# Altium schematic sheet 5_demodulation.SchDoc
size A; SheetNumber: 5; SheetTotal: 7
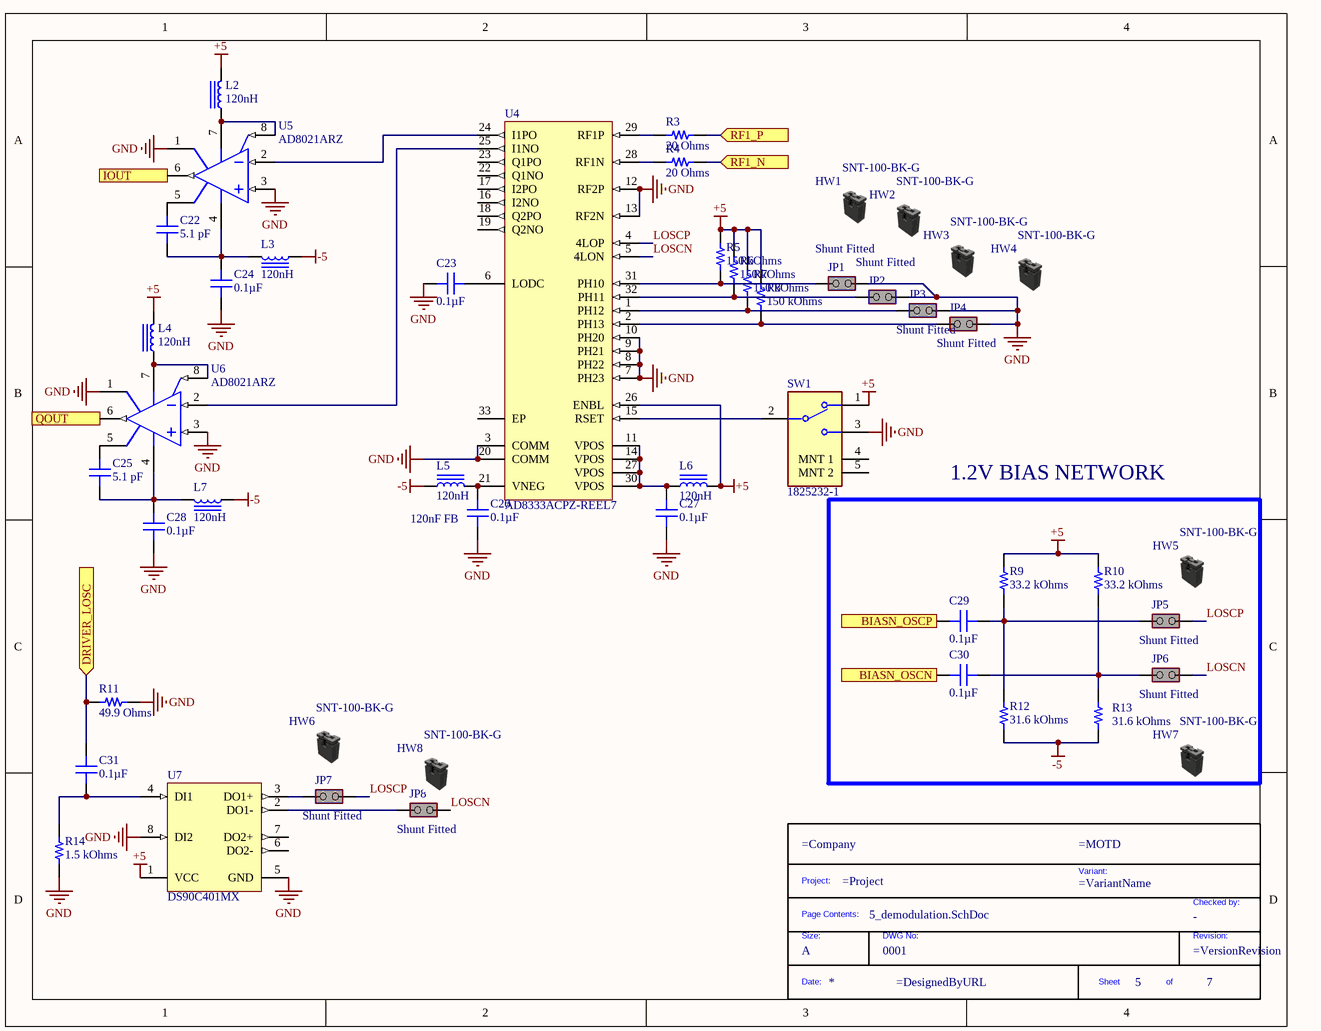
[diagram p0: 5_demodulation.SchDoc]

## Parts
*?  DWG No: 0001  Size: A  (hidden comment: TitleBlock)  (graphical)
C22  5.1 pF  [CAP 1206_3216 - 0.8MM]
C23  0.1µF  [CAP 1206_3216 - 1.0MM]
C24  0.1µF  [CAP 1206_3216 - 1.0MM]
C25  5.1 pF  [CAP 1206_3216 - 0.8MM]
C26  0.1µF  [CAP 1206_3216 - 1.0MM]
C27  0.1µF  [CAP 1206_3216 - 1.0MM]
C28  0.1µF  [CAP 1206_3216 - 1.0MM]
C29  0.1µF  [CAP 1206_3216 - 1.0MM]
C30  0.1µF  [CAP 1206_3216 - 1.0MM]
C31  0.1µF  [CAP 1206_3216 - 1.0MM]
HW1  value SNT-100-BK-G  (hidden comment: Shunt Black 2.54mm)  (mechanical)
HW2  value SNT-100-BK-G  (hidden comment: Shunt Black 2.54mm)  (mechanical)
HW3  value SNT-100-BK-G  (hidden comment: Shunt Black 2.54mm)  (mechanical)
HW4  value SNT-100-BK-G  (hidden comment: Shunt Black 2.54mm)  (mechanical)
HW5  value SNT-100-BK-G  (hidden comment: Shunt Black 2.54mm)  (mechanical)
HW6  value SNT-100-BK-G  (hidden comment: Shunt Black 2.54mm)  (mechanical)
HW7  value SNT-100-BK-G  (hidden comment: Shunt Black 2.54mm)  (mechanical)
HW8  value SNT-100-BK-G  (hidden comment: Shunt Black 2.54mm)  (mechanical)
JP1  value Shunt Fitted  [CON_SAMTEC_TSW-102-07-G-S]  (hidden comment: Jumper_Header 2x1 Fitted)
JP2  value Shunt Fitted  [CON_SAMTEC_TSW-102-07-G-S]  (hidden comment: Jumper_Header 2x1 Fitted)
JP3  value Shunt Fitted  [CON_SAMTEC_TSW-102-07-G-S]  (hidden comment: Jumper_Header 2x1 Fitted)
JP4  value Shunt Fitted  [CON_SAMTEC_TSW-102-07-G-S]  (hidden comment: Jumper_Header 2x1 Fitted)
JP5  value Shunt Fitted  [CON_SAMTEC_TSW-102-07-G-S]  (hidden comment: Jumper_Header 2x1 Fitted)
JP6  value Shunt Fitted  [CON_SAMTEC_TSW-102-07-G-S]  (hidden comment: Jumper_Header 2x1 Fitted)
JP7  value Shunt Fitted  [CON_SAMTEC_TSW-102-07-G-S]  (hidden comment: Jumper_Header 2x1 Fitted)
JP8  value Shunt Fitted  [CON_SAMTEC_TSW-102-07-G-S]  (hidden comment: Jumper_Header 2x1 Fitted)
L2  120nH  [IND 0603_1608 RF WW]
L3  120nH  [IND 0603_1608 RF WW]
L4  120nH  [IND 0603_1608 RF WW]
L5  120nH  [IND 0603_1608 RF WW]
L6  120nH  [IND 0603_1608 RF WW]
L7  120nH  [IND 0603_1608 RF WW]
R3  20 Ohms  [RES 1206_3216]
R4  20 Ohms  [RES 1206_3216]
R5  150 kOhms  [RES 1206_3216]
R6  150 kOhms  [RES 1206_3216]
R7  150 kOhms  [RES 1206_3216]
R8  150 kOhms  [RES 1206_3216]
R9  33.2 kOhms  [RES 1206_3216]
R10  33.2 kOhms  [RES 1206_3216]
R11  49.9 Ohms  [RES 1206_3216]
R12  31.6 kOhms  [RES 1206_3216]
R13  31.6 kOhms  [RES 1206_3216]
R14  1.5 kOhms  [RES 1206_3216]
SW1  1825232-1  [FP-1825232-1-MFG]
U4  AD8333ACPZ-REEL7  [ADI-CP-32-2_L]
U5  AD8021ARZ  [ADI-R-8_N]
U6  AD8021ARZ  [ADI-R-8_N]
U7  DS90C401MX  [D0008A_N]

## Blocks framed on the sheet
1.2V BIAS NETWORK: C29 C30 HW5 HW7 JP5 JP6 R9 R10 R12 R13

## Ports
BIASN_OSCN (in), BIASN_OSCP (in), DRIVER_LOSC (in), IOUT (out), QOUT (out), RF1_N (in), RF1_P (in)

## Nets
+5: L2.2 L4.2 L6.2 R5.2 R6.2 R7.2 R8.2 R9.2 R10.2 SW1.1 U4.26(ENBL) U7.1(VCC)
-5: L3.1 L5.1 L7.1 R12.2 R13.1
GND: C23.2 C24.2 C26.1 C27.1 C28.2 JP1.2(NO) JP2.2(NO) JP3.2(NO) JP4.2(NO) R11.2 R14.2 SW1.3 U4.3(COMM) U4.7(PH23) U4.8(PH22) U4.9(PH21) U4.10(PH20) U4.12(RF2P) U4.13(RF2N) U4.20(COMM) U5.1(LOGIC_REFERENCE) U5.3(+IN) U6.1(LOGIC_REFERENCE) U6.3(+IN) U7.5(GND) U7.8(DI2)
BIASN_OSCN: C30.2 ; port BIASN_OSCN
BIASN_OSCP: C29.2 ; port BIASN_OSCP
DRIVER_LOSC: C31.2 R11.1 ; port DRIVER_LOSC
IOUT: U5.6(VOUT) ; port IOUT
LOSCN: JP6.2(NO) JP8.2(NO) U4.5(4LON)
LOSCP: JP5.2(NO) JP7.2(NO) U4.4(4LOP)
QOUT: U6.6(VOUT) ; port QOUT
RF1_N: R4.2 ; port RF1_N
RF1_P: R3.2 ; port RF1_P
NetC22_1: C22.1 C24.1 L3.2 U5.4(-VS)
NetC22_2: C22.2 U5.5(CCOMP)
NetC23_1: C23.1 U4.6(LODC)
NetC25_1: C25.1 C28.1 L7.2 U6.4(-VS)
NetC25_2: C25.2 U6.5(CCOMP)
NetC26_2: C26.2 L5.2 U4.21(VNEG)
NetC27_2: C27.2 L6.1 U4.11(VPOS) U4.14(VPOS) U4.27(VPOS) U4.30(VPOS)
NetC29_1: C29.1 JP5.1(COMMON) R9.1 R12.1
NetC30_1: C30.1 JP6.1(COMMON) R10.1 R13.2
NetC31_1: C31.1 R14.1 U7.4(DI1)
NetJP1_1: JP1.1(COMMON) R5.1 U4.31(PH10)
NetJP2_1: JP2.1(COMMON) R6.1 U4.32(PH11)
NetJP3_1: JP3.1(COMMON) R7.1 U4.1(PH12)
NetJP4_1: JP4.1(COMMON) R8.1 U4.2(PH13)
NetJP7_1: JP7.1(COMMON) U7.3(DO1+)
NetJP8_1: JP8.1(COMMON) U7.2(DO1-)
NetL2_1: L2.1 U5.7(+VS) U5.8(~{DISABLE})
NetL4_1: L4.1 U6.7(+VS) U6.8(~{DISABLE})
NetR3_1: R3.1 U4.29(RF1P)
NetR4_1: R4.1 U4.28(RF1N)
NetSW1_2: SW1.2 U4.15(RSET)
NetU4_24: U4.24(I1PO) U5.2(-IN)
NetU4_25: U4.25(I1NO) U6.2(-IN)

Not connected (* = marked no-connect by the designer): SW1 4(MNT_1) 5(MNT_2); U4 16(I2NO) 17(I2PO) 18(Q2PO) 19(Q2NO) 22(Q1NO) 23(Q1PO) 33(EP); U7 6(DO2-) 7(DO2+)

## Notes on the sheet
- 120nF FB
- (in symbol TitleBlock) Project:; Variant:; Checked by:; Page Contents:; Size:; DWG No:; Revision:; Date:; Sheet; of

## Library data of the parts
*? = TitleBlock: Standard Title Block; Checked by: -
C22 C25 = C1206C519C5GAC7800: CAP CER 5.1PF 50V C0G/NP0 1206; manufacturer: KEMET; Temperature Coefficient: C0G, NP0; Tolerance: ±0.25pF; Part Number: C1206C519C5GAC7800; Value: 5.1 pF; Applications: General Purpose; Capacitance: 5.1 pF; componentlink1description: Datasheet; componentlink1url: https://api.kemet.com/component-edge/download/datasheet/C1206C519C5GACTU.pdf; componentlink2description: DigiKey Link; componentlink2url: https://www.digikey.com/en/products/detail/kemet/C1206C519C5GAC7800/411185; Device Package: 1206 (3216 Metric); Features: Low ESL; lastupdated: 2023-04-30 19:15:17; Lifecycle Status: Active; Minimum Order: 1; Mounting Type: Surface Mount, MLCC; Operating Temperature: -55°C ~ 125°C; Package / Case: 1206 (3216 Metric); packaging: TapeAndReel; partid: 30067; Part Status: Active; price: 0.16; series: SMD Comm C0G; Size / Dimension: 0.126" L x 0.063" W (3.20mm x 1.60mm); Supplier 1: DigiKey; Supplier Part Number 1: 399-C1206C519C5GAC7800CT-ND; Thickness (Max): 0.035" (0.88mm); Voltage - Rated: 50V
C23 C24 C26-C31 = 12065C104JAT2A: CAP CER 0.1UF 50V X7R 1206; manufacturer: AVX Corporation; Tolerance: ±5%; Part Number: 12065C104JAT2A; Value: 0.1µF; Applications: General Purpose; Capacitance: 0.1µF; componentlink1description: Datasheet; componentlink1url: http://datasheets.avx.com/X7RDielectric.pdf; componentlink2description: DigiKey Link; componentlink2url: http://digikey.com/product-detail/en/avx-corporation/12065C104JAT2A/478-3797-1-ND/1116495; Device Package: 1206 (3216 Metric); lastupdated: 2020-09-02 01:05:06; Lifecycle Status: Active; Minimum Order: 1; Mounting Type: Surface Mount, MLCC; Operating Temperature: -55°C ~ 125°C; Package / Case: 1206 (3216 Metric); packaging: TapeAndReel; partid: 19088; Part Status: Active; price: 0.06; series: -; Size / Dimension: 0.126" L x 0.063" W (3.20mm x 1.60mm); Supplier 1: DigiKey; Supplier Part Number 1: 478-3797-1-ND; Temperature Coefficient: X7R; Thickness (Max): 0.037" (0.94mm); Voltage - Rated: 50V
HW1-HW8 = MCD-00043: SHUNT 2.54mm BLACK; Manufacturer: SAMTEC; Part_Type: Mechanical; Alternate_Manufacturer_Part_Number: 316102S111A; Alternate_Manufacturer: JIUBABA; Provided_By: SUBCO; Internal_Part_Number: MCD-00043; Manufacturer_Part_Number: SNT-100-BK-G; ComponentLink1Description: Datasheet; Status: Released; ComponentLink1URL: http://tunmcdsvn.tun.st.com/Component_Datasheet_Library/Trunk/Connectors/Samtec_Shunt_Jumper_SNT100; ECCN_US: n/a; ECCN_EU: n/a
JP1-JP8 = MCD-00683: Header, 2x1, 2,54mm, VR, TH, Height 5.84mm/2.54mm - Shunt Fitted by default; Part_Type: Connector; Manufacturer_Part_Number: TSW-102-07-x-S; Manufacturer: SAMTEC; Alternate_Manufacturer_Part_Number: 313102S111116; Alternate_Manufacturer: LIANYI; Provided_By: SUBCO; Internal_Part_Number: MCD-00683; Status: Released; ComponentLink1Description: Datasheet; ComponentLink1URL: http://tunmcdsvn.tun.st.com/Component_Datasheet_Library/Trunk/Connectors/Samtec_TSW-HTSW-series; ECCN_US: n/a; ECCN_EU: n/a
L2-L4 L6 L7 = LQW18CAR12J00D: FIXED IND 120NH 1500MA 58MOHM; Manufacturer: Murata Electronics; Current Rating (Amps): 1.5A; DC Resistance (DCR): 58mOhm Max; Frequency - Self Resonant: 1.5GHz; Inductance Frequency - Test: 10MHz; Material - Core: Ferrite; Shielding: Unshielded; Tolerance: ±5%; Type: Wirewound; Part Number: LQW18CAR12J00D; ComponentLink1Description: Datasheet; ComponentLink1URL: https://search.murata.co.jp/Ceramy/image/img/P02/JELF243A-0159.pdf; ComponentLink2Description: DigiKey Link; ComponentLink2URL: http://digikey.com/product-detail/en/murata-electronics/LQW18CAR12J00D/490-18177-1-ND/9742079; Device Package: 0603 (1608 Metric); Height - Seated (Max): 0.037" (0.95mm); Inductance: 120nH; LastUpdated: 2020-09-06 11:05:19; Lifecycle Status: Active; Minimum Order: 1; Mounting Type: Surface Mount; Operating Temperature: -40°C ~ 85°C; Package / Case: 0603 (1608 Metric); Packaging: TapeAndReel; PartId: 1197; Part Status: Active; Price: 0.22; Series: LQW18; Size / Dimension: 0.063" L x 0.031" W (1.60mm x 0.80mm); Supplier 1: DigiKey; Supplier Part Number 1: 490-18177-1-ND; Supplier Device Package: 0603; Value: 120nH
L5 = 744761212C: FIXED IND 120NH 300MA 650 MOHM; Manufacturer: Würth Elektronik; DC Resistance (DCR): 650mOhm Max; Frequency - Self Resonant: 1.3GHz; Inductance Frequency - Test: 150MHz; Material - Core: Ceramic; Q @ Freq: 30 @ 150MHz; Shielding: Unshielded; Tolerance: ±5%; Type: Wirewound; Part Number: 744761212C; ComponentLink1Description: Datasheet; ComponentLink1URL: https://katalog.we-online.de/pbs/datasheet/744761212C.pdf; ComponentLink2Description: DigiKey Link; ComponentLink2URL: http://digikey.com/product-detail/en/w-rth-elektronik/744761212C/732-1768-1-ND/1994348; Current Rating (Amps): 300mA; Device Package: 0603 (1608 Metric); Height - Seated (Max): 0.043" (1.10mm); Inductance: 120nH; LastUpdated: 2020-09-06 11:05:21; Lifecycle Status: Active; Minimum Order: 1; Mounting Type: Surface Mount; Operating Temperature: -40°C ~ 125°C; Package / Case: 0603 (1608 Metric); Packaging: TapeAndReel; PartId: 1481; Part Status: Active; Price: 0.23; Series: WE-KI; Size / Dimension: 0.065" L x 0.045" W (1.65mm x 1.15mm); Supplier 1: DigiKey; Supplier Part Number 1: 732-1768-1-ND; Supplier Device Package: 0603 (1608 Metric); Value: 120nH
R3 R4 = RNCP1206FTD20R0: RES 20 OHM 1% 1/2W 1206; Manufacturer: Stackpole Electronics Inc; Power (Watts): 0.5W, 1/2W; Temperature Coefficient: ±100ppm/°C; Part Number: RNCP1206FTD20R0; ComponentLink1Description: Datasheet; ComponentLink1URL: https://www.seielect.com/catalog/sei-rncp.pdf; ComponentLink2Description: DigiKey Link; ComponentLink2URL: https://www.digikey.com/en/products/detail/stackpole-electronics-inc/RNCP1206FTD20R0/2240306; Composition: Thin Film; Device Package: 1206 (3216 Metric); Features: Anti-Sulfur; Height - Seated (Max): 0.025" (0.65mm); LastUpdated: 2022-09-19 13:29:44; Lifecycle Status: Active; Minimum Order: 1; Number of Terminations: 2; Operating Temperature: -55°C ~ 155°C; Package / Case: 1206 (3216 Metric); Packaging: TapeAndReel; PartId: 29216; Part Status: Active; Price: 0.01; Resistance: 20 Ohms; Series: RNCP; Size / Dimension: 0.122" L x 0.059" W (3.10mm x 1.50mm); Supplier 1: DigiKey; Supplier Part Number 1: RNCP1206FTD20R0CT-ND; Supplier Device Package: 1206; Tolerance: ±1%; Value: 20 Ohms
R5-R8 = KTR18EZPF1503: RES SMD 150K OHM 1% 1/4W 1206; Manufacturer: Rohm Semiconductor; Power (Watts): 0.25W, 1/4W; Temperature Coefficient: ±100ppm/°C; Part Number: KTR18EZPF1503; ComponentLink1Description: Datasheet; ComponentLink1URL: https://www.rohm.com/datasheet/KTR03EZPF/ktr-e; ComponentLink2Description: DigiKey Link; ComponentLink2URL: https://www.digikey.com/en/products/detail/rohm-semiconductor/KTR18EZPF1503/1983702; Composition: Thick Film; Device Package: 1206 (3216 Metric); Features: Automotive AEC-Q200, High Voltage; Height - Seated (Max): 0.026" (0.65mm); LastUpdated: 2022-09-19 13:29:15; Lifecycle Status: Active; Minimum Order: 1; Number of Terminations: 2; Operating Temperature: -55°C ~ 155°C; Package / Case: 1206 (3216 Metric); Packaging: TapeAndReel; PartId: 35710; Part Status: Active; Price: 0.03; Ratings: AEC-Q200; Resistance: 150 kOhms; Series: KTR; Size / Dimension: 0.126" L x 0.063" W (3.20mm x 1.60mm); Supplier 1: DigiKey; Supplier Part Number 1: RHM150KAICT-ND; Supplier Device Package: 1206; Tolerance: ±1%; Value: 150 kOhms
R9 R10 = RK73H2BTTD3322F: RES 33.2K OHM 1% 1/4W 1206; Manufacturer: KOA Speer Electronics, Inc.; Power (Watts): 0.25W, 1/4W; Temperature Coefficient: ±100ppm/°C; Part Number: RK73H2BTTD3322F; ComponentLink1Description: Datasheet; ComponentLink1URL: http://www.koaspeer.com/catimages/Products/RK73H/RK73H.pdf; ComponentLink2Description: DigiKey Link; ComponentLink2URL: https://www.digikey.com/en/products/detail/koa-speer-electronics-inc/RK73H2BTTD3322F/10235905; Composition: Thick Film; Device Package: 1206 (3216 Metric); Features: Automotive AEC-Q200, Moisture Resistant; Height - Seated (Max): 0.028" (0.70mm); LastUpdated: 2022-09-19 13:29:27; Lifecycle Status: Active; Minimum Order: 1; Number of Terminations: 2; Operating Temperature: -55°C ~ 155°C; Package / Case: 1206 (3216 Metric); Packaging: CutTape; PartId: 33401; Part Status: Active; Price: 0.01; Ratings: AEC-Q200; Resistance: 33.2 kOhms; Series: RK73H; Size / Dimension: 0.126" L x 0.063" W (3.20mm x 1.60mm); Supplier 1: DigiKey; Supplier Part Number 1: 2019-RK73H2BTTD3322FCT-ND; Supplier Device Package: 1206; Tolerance: ±1%; Value: 33.2 kOhms
R11 = RT1206BRD0749R9L: RES SMD 49.9 OHM 0.1% 1/4W 1206; Manufacturer: Yageo; Power (Watts): 0.25W, 1/4W; Temperature Coefficient: ±25ppm/°C; Part Number: RT1206BRD0749R9L; ComponentLink1Description: Datasheet; ComponentLink1URL: https://www.yageo.com/upload/media/product/productsearch/datasheet/rchip/PYu-RT_1-to-0.01_RoHS_L_11.pdf; ComponentLink2Description: DigiKey Link; ComponentLink2URL: https://www.digikey.com/en/products/detail/yageo/RT1206BRD0749R9L/1079849; Composition: Thin Film; Device Package: 1206 (3216 Metric); Height - Seated (Max): 0.026" (0.65mm); LastUpdated: 2023-04-30 19:44:00; Lifecycle Status: Active; Minimum Order: 1; Number of Terminations: 2; Operating Temperature: -55°C ~ 155°C; Package / Case: 1206 (3216 Metric); Packaging: TapeAndReel; PartId: 26863; Part Status: Active; Price: 0.09; Resistance: 49.9 Ohms; Series: RT; Size / Dimension: 0.122" L x 0.063" W (3.10mm x 1.60mm); Supplier 1: DigiKey; Supplier Part Number 1: YAG5080CT-ND; Supplier Device Package: 1206; Tolerance: ±0.1%; Value: 49.9 Ohms
R12 R13 = RC1206FR-0731K6L: RES 31.6K OHM 1% 1/4W 1206; Manufacturer: Yageo; Power (Watts): 0.25W, 1/4W; Temperature Coefficient: ±100ppm/°C; Part Number: RC1206FR-0731K6L; ComponentLink1Description: Datasheet; ComponentLink1URL: https://www.yageo.com/upload/media/product/productsearch/datasheet/rchip/PYu-RC_Group_51_RoHS_L_10.pdf; ComponentLink2Description: DigiKey Link; ComponentLink2URL: https://www.digikey.com/en/products/detail/yageo/RC1206FR-0731K6L/728811; Composition: Thick Film; Device Package: 1206 (3216 Metric); Features: Moisture Resistant; Height - Seated (Max): 0.026" (0.65mm); LastUpdated: 2022-09-19 13:29:31; Lifecycle Status: Active; Minimum Order: 1; Number of Terminations: 2; Operating Temperature: -55°C ~ 155°C; Package / Case: 1206 (3216 Metric); Packaging: TapeAndReel; PartId: 32438; Part Status: Active; Price: 0.01; Resistance: 31.6 kOhms; Series: RC_L; Size / Dimension: 0.122" L x 0.063" W (3.10mm x 1.60mm); Supplier 1: DigiKey; Supplier Part Number 1: 311-31.6KFRCT-ND; Supplier Device Package: 1206; Tolerance: ±1%; Value: 31.6 kOhms
R14 = CRGP1206F1K5: RES 1.5K OHM 1% 1/2W 1206; Manufacturer: TE Connectivity Passive Product; Power (Watts): 0.5W, 1/2W; Temperature Coefficient: ±100ppm/°C; Part Number: CRGP1206F1K5; ComponentLink1Description: Datasheet; ComponentLink1URL: https://www.te.com/commerce/DocumentDelivery/DDEController?Action=srchrtrv&DocNm=9-1773463-9&DocType=DS&DocLang=English; ComponentLink2Description: DigiKey Link; ComponentLink2URL: https://www.digikey.com/en/products/detail/te-connectivity-passive-product/CRGP1206F1K5/8577142; Composition: Thick Film; Device Package: 1206 (3216 Metric); Features: Pulse Withstanding; Height - Seated (Max): 0.026" (0.65mm); LastUpdated: 2023-04-30 19:43:51; Lifecycle Status: Active; Minimum Order: 1; Number of Terminations: 2; Operating Temperature: -55°C ~ 155°C; Package / Case: 1206 (3216 Metric); Packaging: TapeAndReel; PartId: 27822; Part Status: Active; Price: 0.03; Resistance: 1.5 kOhms; Series: CRGP; Size / Dimension: 0.122" L x 0.061" W (3.10mm x 1.55mm); Supplier 1: DigiKey; Supplier Part Number 1: A130540CT-ND; Supplier Device Package: 1206; Tolerance: ±1%; Value: 1.5 kOhms
SW1 = CMP-03405-000001-1: SWITCH SLIDE SPDT 200MA 30V; Manufacturer: TE Connectivity; Contact Current Rating: 0.2A; Contact Resistance: 20mΩ; Electromechanical Life: 10000Cycles; Operating Force: 200gf; Throw Configuration: SPDT; Manufacturer Part Number: 1825232-1; Temperature Range High: +70°C; Height: 3.7mm; ComponentLink2URL: https://www.te.com/commerce/DocumentDelivery/DDEController?Action=showdoc&DocId=Customer+Drawing%7F1825232%7FB2%7Fpdf%7FEnglish%7FENG_CD_1825232_B2.pdf%7F1825232-1; Mount: Through Hole; Mouser Description: Slide Switches SLIDE SWITCH SPDT Right Angle; Package: 1825232-1; Temperature: -20°C to +70°C; Automotive: No; ComponentLink2Description: Datasheet; Lead Free: Yes; Octopart: https://octopart.com/1825232-1-te+connectivity-45209882; Device Class L1: Electromechanical; Digikey Description: SWITCH SLIDE SPDT 200MA 30V; Device Class L3: Slide Switches; Device Class L2: Switches; Voltage Rating Dc: 30V; Temperature Range Low: -20°C; Category: Switch; RoHS: TRUE
U4 = CMP-0285-00056-1: DC to 50 MHz, Dual I/Q Demodulator and Phase Shifter, CP-32-2, Pb-Free, 1500 Reel; Min RF Frequency (MHz): 0Hz; Amplitude Error (dB): 50mdB; IIP3 (+dBm): 30dBm; Phase Error (deg): 0.1Deg; Max RF Frequency (MHz): 50MHz; DatasheetVersion: Rev. D; ComponentLink1URL: www.analog.com; ComponentLink2Description: Datasheet; Code_JEDEC: MO-220-VHHD-2; ComponentLink3Description: Package Specification; PackageDescription: 32-Lead Lead Frame Chip Scale Package [LFCSP_VQ]; ComponentLink3URL: http://www.analog.com/static/imported-files/packages/414143737956480539664569CP_32_2.pdf; PackageReference: CP-32-2; ComponentLink1Description: Manufacturer URL; PackageVersion: Jan-2005; ComponentLink2URL: http://www.analog.com/static/imported-files/data_sheets/AD8333.pdf
U5 U6 = CMP-0384-00646-2: Single Channel Low Power Operational Amplifier, 490 MHz BW, 120 V/us SR, Industrial, 8-pin SOIC (R-8), Tube; Manufacturer: Analog Devices; Generic Part Number: AD8021; Small Signal Bandwidth: 490MHz; Iq/Amp: 7.7mA; V Span Max: 24V; V Span Min: 4.5V; Amplifiers Per Package: 1; Input Offset Voltage: 400uV; Input Bias Current: 7.5uA; Code_JEDEC: MS-012-AA; ComponentLink3Description: Package Specification; PackageDescription: 8-Pin Standard Small Outline Package, Body 3.9 x 4.9 mm, Pitch 1.27 mm; ComponentLink1URL: http://www.analog.com/en/index.html; PackageVersion: 060506-A; ComponentLink4Description: Reference Circuit; Mounting Technology: Surface Mount; ComponentLink4URL: http://www.analog.com/en/all-operational-amplifiers-op-amps/operational-amplifiers-op-amps/ad8021/products/product.html#product-recommendations; RevisionNote: Reference Circuit URL fixed; DatasheetVersion: Rev. F; ComponentLink2URL: http://www.analog.com/static/imported-files/data_sheets/AD8021.pdf; PackageReference: R-8; ComponentLink1Description: Manufacturer URL; ComponentLink3URL: http://www.analog.com/static/imported-files/packages/PKG_PDF/SOIC_Narrow%20(R)/R_8.pdf; ComponentLink2Description: Datasheet; Slew Rate: 120V/us; PartNumber: AD8021ARZ
U7 = CMP-0058-00917-3: Dual Low Voltage Differential Signaling (LVDS) Driver, 8 pin SOIC NARROW; Manufacturer: Texas Instruments; CompType: Interface IC; PackageTopMarking: NSZXTT*DS90C*401M; PowerWise: N; Code_JEDEC: MS-012-AA; PinCount: 8; RoHS: N; PackageDescription: SOIC Narrow, 4.9 x 3.9 x 1.45mm, 8 Lead, 1.27mm Pitch; Code_IPC: SOIC127P600-8; ComponentLink1Description: Datasheet URL; ComponentLink1URL: http://www.ti.com/general/docs/lit/getliterature.tsp?genericPartNumber=DS90C401&fileType=pdf; PackageReference: D0008A